# Altium schematic sheet EN-C200_RA0_NB-IoT_只有元器件.SchDoc
size A4
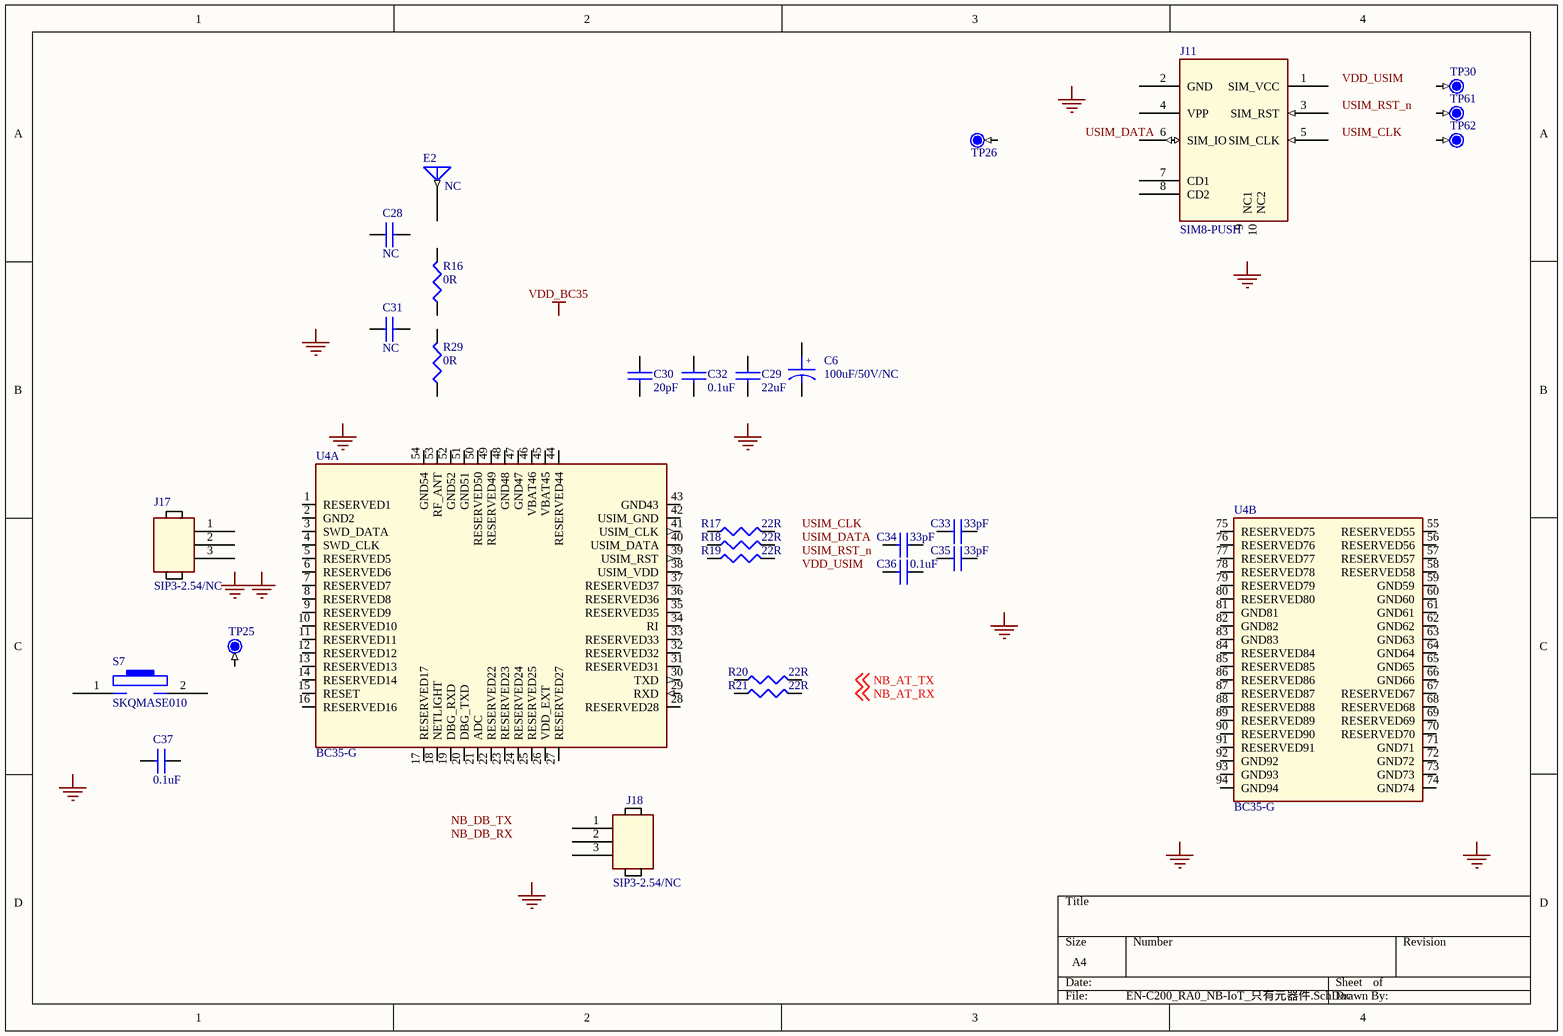
[diagram p0: EN-C200_RA0_NB-IoT_只有元器件.SchDoc]

## Parts
C6  100uF/50V/NC  [CAP_SMD_6_3MM]
C28  NC  [SC0603]
C29  22uF  [SC0805]
C30  20pF  [SC0603]
C31  NC  [SC0603]
C32  0.1uF  [SC0603]
C33  33pF  [SC0603]
C34  33pF  [SC0603]
C35  33pF  [SC0603]
C36  0.1uF  [SC0603]
C37  0.1uF  [SC0603]
E2  NC  [NB-ANT]
J11  SIM8-PUSH  [SIM8-50]
J17  SIP3-2.54/NC  [SIP-3P]
J18  SIP3-2.54/NC  [SIP-3P]
R16  0R  [SR0603]
R17  22R  [SR0603]
R18  22R  [SR0603]
R19  22R  [SR0603]
R20  22R  [SR0603]
R21  22R  [SR0603]
R29  0R  [SR0603]
S7  SKQMASE010  [SW2-240X140]
TP25  NC  [TP32-SMD]  (value not drawn)
TP26  NC  [TP32-SMD]  (value not drawn)
TP30  NC  [TP32-SMD]  (value not drawn)
TP61  NC  [TP32-SMD]  (value not drawn)
TP62  NC  [TP32-SMD]  (value not drawn)
U4  BC35-G  [BC35-G]  (parts A,B of 2)

## Nets
GND: E2.2 E2.3

Not connected (* = marked no-connect by the designer): C6 1 2; C28 1 2; C29 1 2; C30 1 2; C31 1 2; C32 1 2; C33 1 2; C34 1 2; C35 1 2; C36 1 2; C37 1 2; E2 1; J11 1(SIM_VCC) 2(GND) 3(SIM_RST) 4(VPP) 5(SIM_CLK) 6(SIM_IO) 7(CD1) 8(CD2) 9(NC1) 10(NC2); J17 1 2 3; J18 1 2 3; R16 1 2; R17 1 2; R18 1 2; R19 1 2; R20 1 2; R21 1 2; R29 1 2; S7 1(A) 2(B); TP25 1; TP26 1; TP30 1; TP61 1; TP62 1; U4 1(RESERVED1) 2(GND2) 3(SWD_DATA) 4(SWD_CLK) 5(RESERVED5) 6(RESERVED6) 7(RESERVED7) 8(RESERVED8) 9(RESERVED9) 10(RESERVED10) 11(RESERVED11) 12(RESERVED12) 13(RESERVED13) 14(RESERVED14) 15(RESET) 16(RESERVED16) 17(RESERVED17) 18(NETLIGHT) 19(DBG_RXD) 20(DBG_TXD) 21(ADC) 22(RESERVED22) 23(RESERVED23) 24(RESERVED24) 25(RESERVED25) 26(VDD_EXT) 27(RESERVED27) 28(RESERVED28) 29(RXD) 30(TXD) 31(RESERVED31) 32(RESERVED32) 33(RESERVED33) 34(RI) 35(RESERVED35) 36(RESERVED36) 37(RESERVED37) 38(USIM_VDD) 39(USIM_RST) 40(USIM_DATA) 41(USIM_CLK) 42(USIM_GND) 43(GND43) 44(RESERVED44) 45(VBAT45) 46(VBAT46) 47(GND47) 48(GND48) 49(RESERVED49) 50(RESERVED50) 51(GND51) 52(GND52) 53(RF_ANT) 54(GND54) 55(RESERVED55) 56(RESERVED56) 57(RESERVED57) 58(RESERVED58) 59(GND59) 60(GND60) 61(GND61) 62(GND62) 63(GND63) 64(GND64) 65(GND65) 66(GND66) 67(RESERVED67) 68(RESERVED68) 69(RESERVED69) 70(RESERVED70) 71(GND71) 72(GND72) 73(GND73) 74(GND74) 75(RESERVED75) 76(RESERVED76) 77(RESERVED77) 78(RESERVED78) 79(RESERVED79) 80(RESERVED80) 81(GND81) 82(GND82) 83(GND83) 84(RESERVED84) 85(RESERVED85) 86(RESERVED86) 87(RESERVED87) 88(RESERVED88) 89(RESERVED89) 90(RESERVED90) 91(RESERVED91) 92(GND92) 93(GND93) 94(GND94)

## Notes on the sheet
- Labels drawn without touching a wire or pin: GND, NB_AT_RX, NB_AT_TX, NB_DB_RX, NB_DB_TX, USIM_CLK, USIM_DATA, USIM_RST_n, VDD_BC35, VDD_USIM
- (in symbol CAP POL) +

## Library data of the parts
C6 = CAP POL
C28-C37 = CAP NP
E2 = ANTENNA
J17 J18 = HEADER3
R16-R21 R29 = RESISTOR
S7 = PUSH-KEY
TP25 TP26 TP30 TP61 TP62 = TP
U4 = BC35-G: SPLIT_INST: TRUE; SWAP_INFO: (S1+S2)